# EAGLE design main_board (EAGLE 7.2.0)
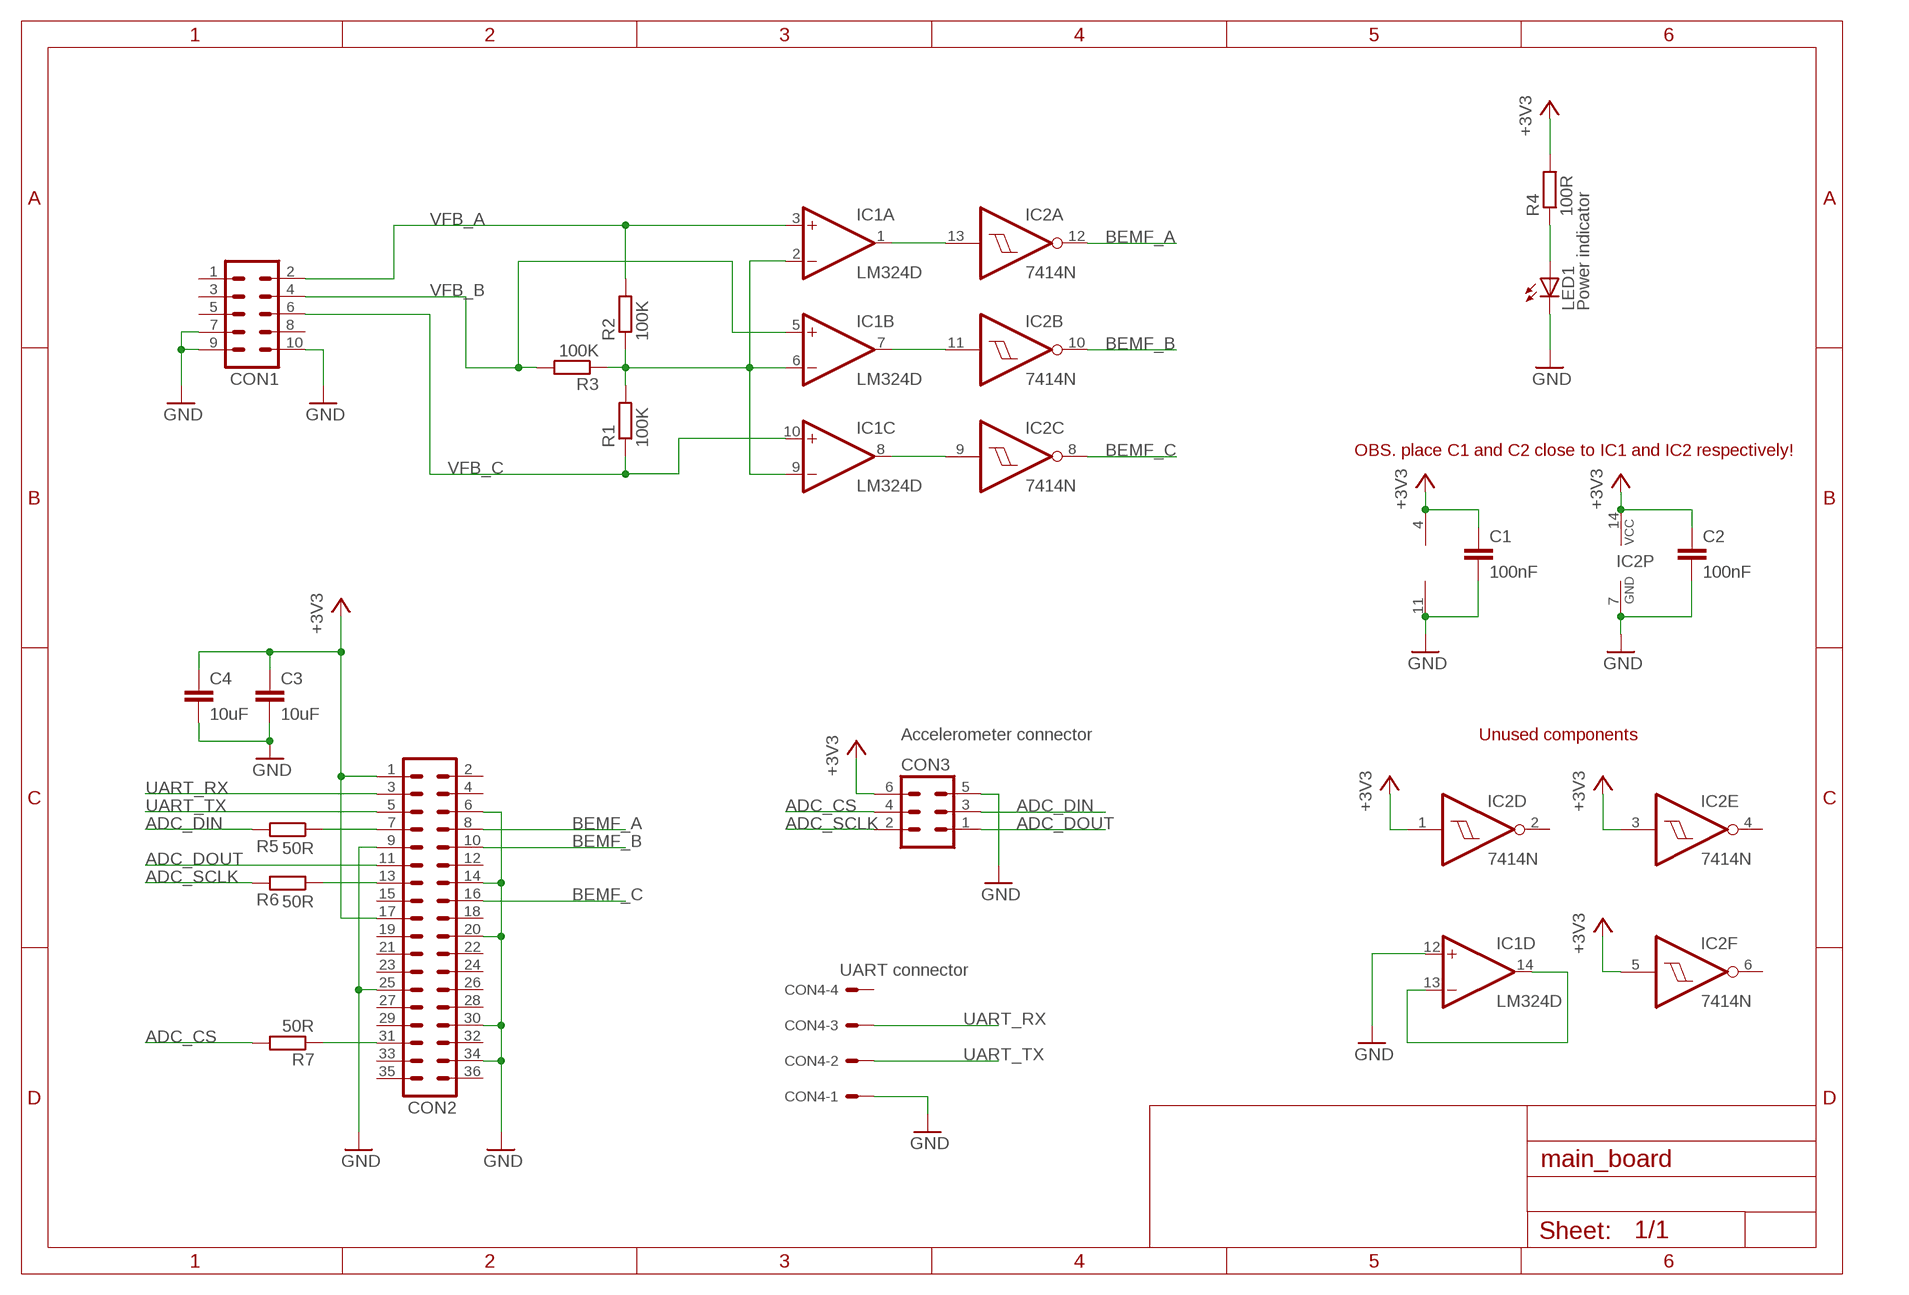
[diagram p0: schematic, sheet 1]

## Parts
C1  100nF  C-EUC0805K  [C0805K]
C2  100nF  C-EUC0805K  [C0805K]
C3  10uF  C-EUC1206K  [C1206K]
C4  10uF  C-EUC1206K  [C1206K]
CON1  MA05-2  [MA05-2]
CON2  MA18-2  [MA18-2]
CON3  Accelerometer connector  ML6  [ML6]
CON4  UART connector  22-27-2041-04  [6410-04]
IC1  LM324D  [SO14]
IC2  7414N  [DIL14]
LED1  Power indicator  LEDCHIP-LED0805  [CHIP-LED0805]
R1  100K  R-EU_R0805  [R0805]
R2  100K  R-EU_R0805  [R0805]
R3  100K  R-EU_R0805  [R0805]
R4  100R  R-EU_R0805  [R0805]
R5  50R  R-EU_R0805  [R0805]
R6  50R  R-EU_R0805  [R0805]
R7  50R  R-EU_R0805  [R0805]

## Nets
+3V3: C1.1 C2.1 C3.1 C4.1 CON2.1 CON2.17 CON3.6 IC1.4(P:V+) IC2.1(D:I) IC2.3(E:I) IC2.5(F:I) IC2.14(P:VCC) R4.2
ADC_CS: CON3.4 R7.2
ADC_DIN: CON3.3 R5.2
ADC_DOUT: CON2.11 CON3.1
ADC_SCLK: CON3.2 R6.2
BEMF_A: CON2.8 IC2.12(A:O)
BEMF_B: CON2.10 IC2.10(B:O)
BEMF_C: CON2.16 IC2.8(C:O)
GND: C1.2 C2.2 C3.2 C4.2 CON1.7 CON1.9 CON1.10 CON2.6 CON2.9 CON2.14 CON2.20 CON2.25 CON2.30 CON2.34 CON3.5 CON4.1 IC1.11(P:V-) IC1.12(D:+IN) IC2.7(P:GND) LED1.C
N$1: IC1.1(A:OUT) IC2.13(A:I)
N$2: IC1.7(B:OUT) IC2.11(B:I)
N$3: IC1.8(C:OUT) IC2.9(C:I)
N$4: IC1.2(A:-IN) IC1.6(B:-IN) IC1.9(C:-IN) R1.2 R2.1 R3.1
N$5: CON2.7 R5.1
N$6: CON2.13 R6.1
N$7: LED1.A R4.1
N$8: CON2.31 R7.1
N$9: IC1.13(D:-IN) IC1.14(D:OUT)
UART_RX: CON2.3 CON4.3
UART_TX: CON2.5 CON4.2
VFB_A: CON1.2 IC1.3(A:+IN) R2.2
VFB_B: CON1.4 IC1.5(B:+IN) R3.2
VFB_C: CON1.6 IC1.10(C:+IN) R1.1
Unconnected: CON1.1 CON1.3 CON1.5 CON1.8 CON2.2 CON2.4 CON2.12 CON2.15 CON2.18 CON2.19 CON2.21 CON2.22 CON2.23 CON2.24 CON2.26 CON2.27 CON2.28 CON2.29 CON2.32 CON2.33 CON2.35 CON2.36 CON4.4 IC2.2(D:O) IC2.4(E:O) IC2.6(F:O)

## Notes on the sheet
- OBS. place C1 and C2 close to IC1 and IC2 respectively!
- Unused components

## Library data of the parts
C1-C4 = rcl:C-EU: CAPACITOR, European symbol
CON1 = con-lstb:MA05-2: PIN HEADER; OC_FARNELL: unknown; OC_NEWARK: unknown
CON2 = con-lstb:MA18-2: PIN HEADER; OC_FARNELL: unknown; OC_NEWARK: unknown
CON3 = con-harting-ml:ML6: HARTING; OC_FARNELL: unknown; OC_NEWARK: unknown
CON4 = con-molex:22-?-04: CONNECTOR wire to board 2.54 mm (.1 inch) pitch header; OC_FARNELL: unknown; OC_NEWARK: unknown
IC1 = linear:LM324: OP AMP
IC2 = 74xx-eu:74*14: Hex schmitt trigger INVERTER
LED1 = led:LED: LED OSRAM: - CHIPLED LG R971, LG N971, LY N971, LG Q971, LY Q971, LO R971, LY R971 LH N974, LH R974 LS Q976, LO Q976, LY Q976 LO Q996 - Hyper CHIPLED LW Q18S LB Q993, LB Q99A, LB R99A - SideLED LS A670, LO A670, LY A670, LG A670, LP A670 LB A673, LV A673, LT A673, LW A673 LH A674 LY A675 LS A676, LA A676, LO A676, LY A676, LW A676 LS A679, LY A679, LG A679 - Hyper Micro SIDELED® LS Y876, LA Y876, LO Y876, LY Y876 LT Y87S - SmartLED LW L88C, LW L88S LB L89C, LB L89S, LG L890 LS L89K, LO L89K, LY L89K LS L896, LA L896, LO L896, LY L896 - TOPLED LS T670, LO T670, LY T670, LG T670, LP T670 LSG T670, LSP T670, LSY T670, LOP T670, LYG T670 LG T671, LOG T671, LSG T671 LB T673, LV T673, LT T673, LW T673 LH T674 LS T676, LA T676, LO T676, LY T676, LB T676, LH T676, LSB T676, LW T676 LB T67C, LV T67C, LT T67C, LS T67K, LO T67K, LY T67K, LW E67C LS E67B, LA E67B, LO E67B, LY E67B, LB E67C, LV E67C, LT E67C LW T67C LS T679, LY T679, LG T679 LS T770, LO T770, LY T770, LG T770, LP T770 LB T773, LV T773, LT T773, LW T773 LH T774 LS E675, LA E675, LY E675, LS T675 LS T776, LA T776, LO T776, LY T776, LB T776 LHGB T686 LT T68C, LB T68C - Hyper Mini TOPLED® LB M676 - Mini TOPLED Santana® LG M470 LS M47K, LO M47K, LY M47K Source: http://www.osram.convergy.de LUXEON: - LUMILED® LXK2-PW12-R00, LXK2-PW12-S00, LXK2-PW14-U00, LXK2-PW14-V00 LXK2-PM12-R00, LXK2-PM12-S00, LXK2-PM14-U00 LXK2-PE12-Q00, LXK2-PE12-R00, LXK2-PE12-S00, LXK2-PE14-T00, LXK2-PE14-U00 LXK2-PB12-K00, LXK2-PB12-L00, LXK2-PB12-M00, LXK2-PB14-N00, LXK2-PB14-P00, LXK2-PB14-Q00 LXK2-PR12-L00, LXK2-PR12-M00, LXK2-PR14-Q00, LXK2-PR14-R00 LXK2-PD12-Q00, LXK2-PD12-R00, LXK2-PD12-S00 LXK2-PH12-R00, LXK2-PH12-S00 LXK2-PL12-P00, LXK2-PL12-Q00, LXK2-PL12-R00 Source: www.luxeon.com KINGBRIGHT: KA-3528ASYC Source: www.kingbright.com
R1-R7 = rcl:R-EU_: RESISTOR, European symbol

## Board
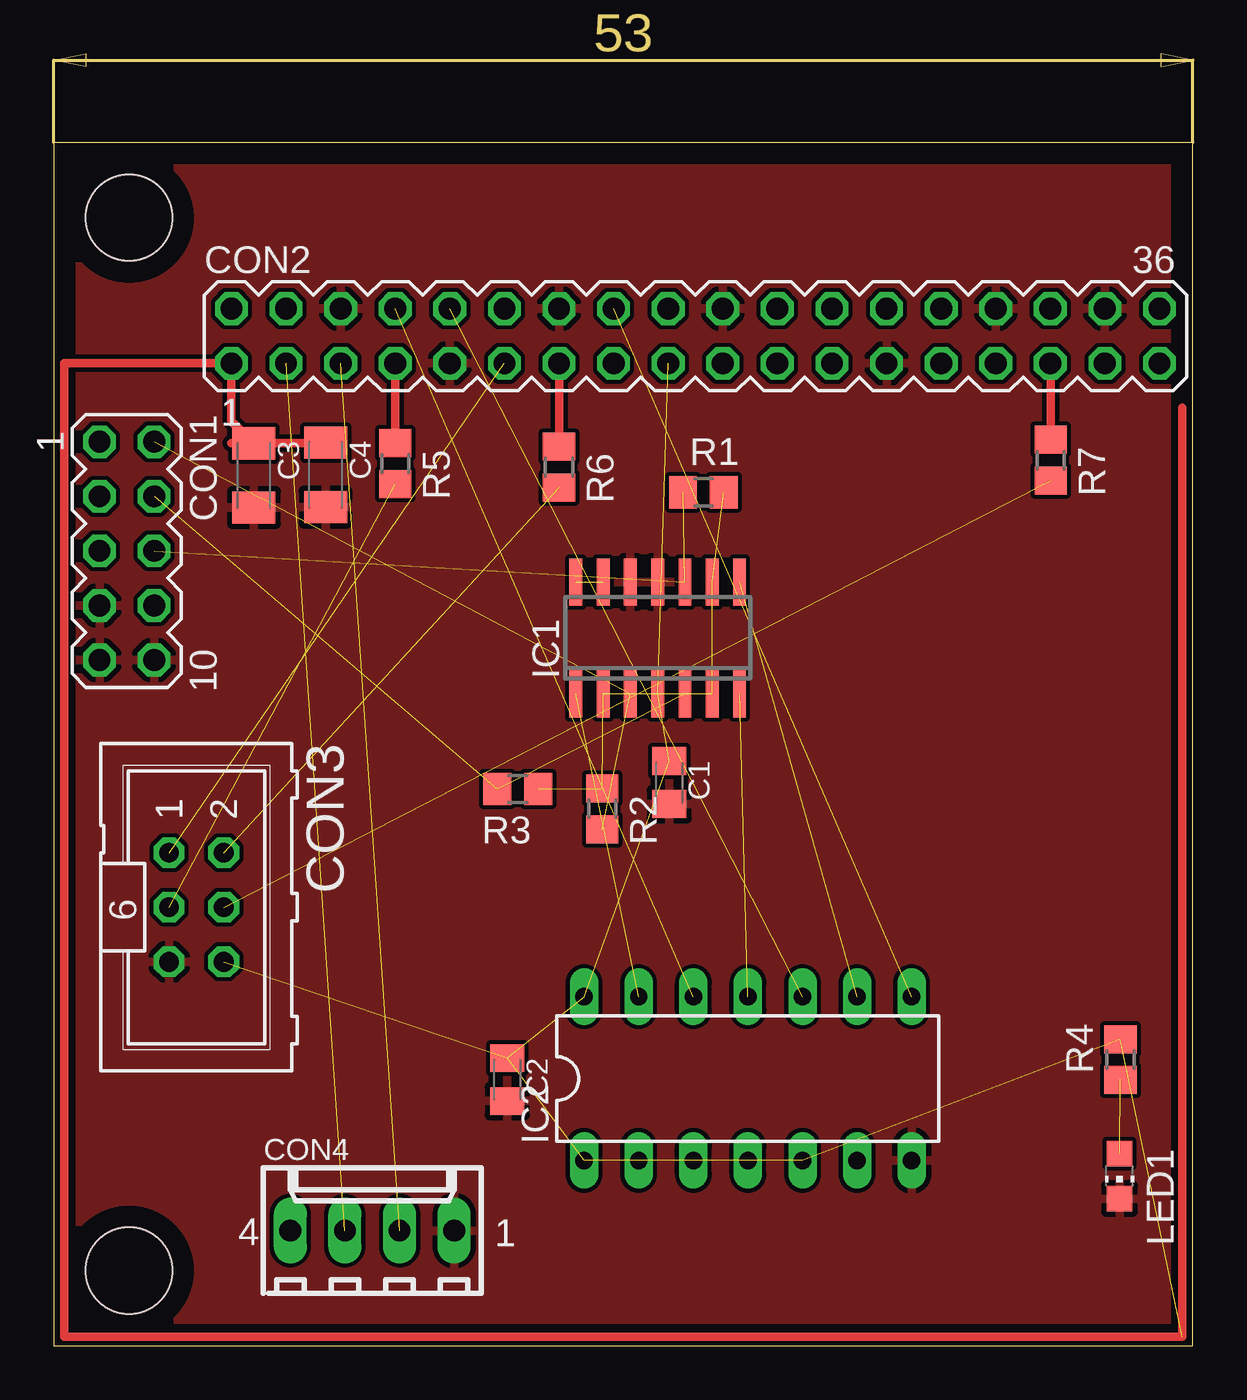
[diagram p1: board, top side]
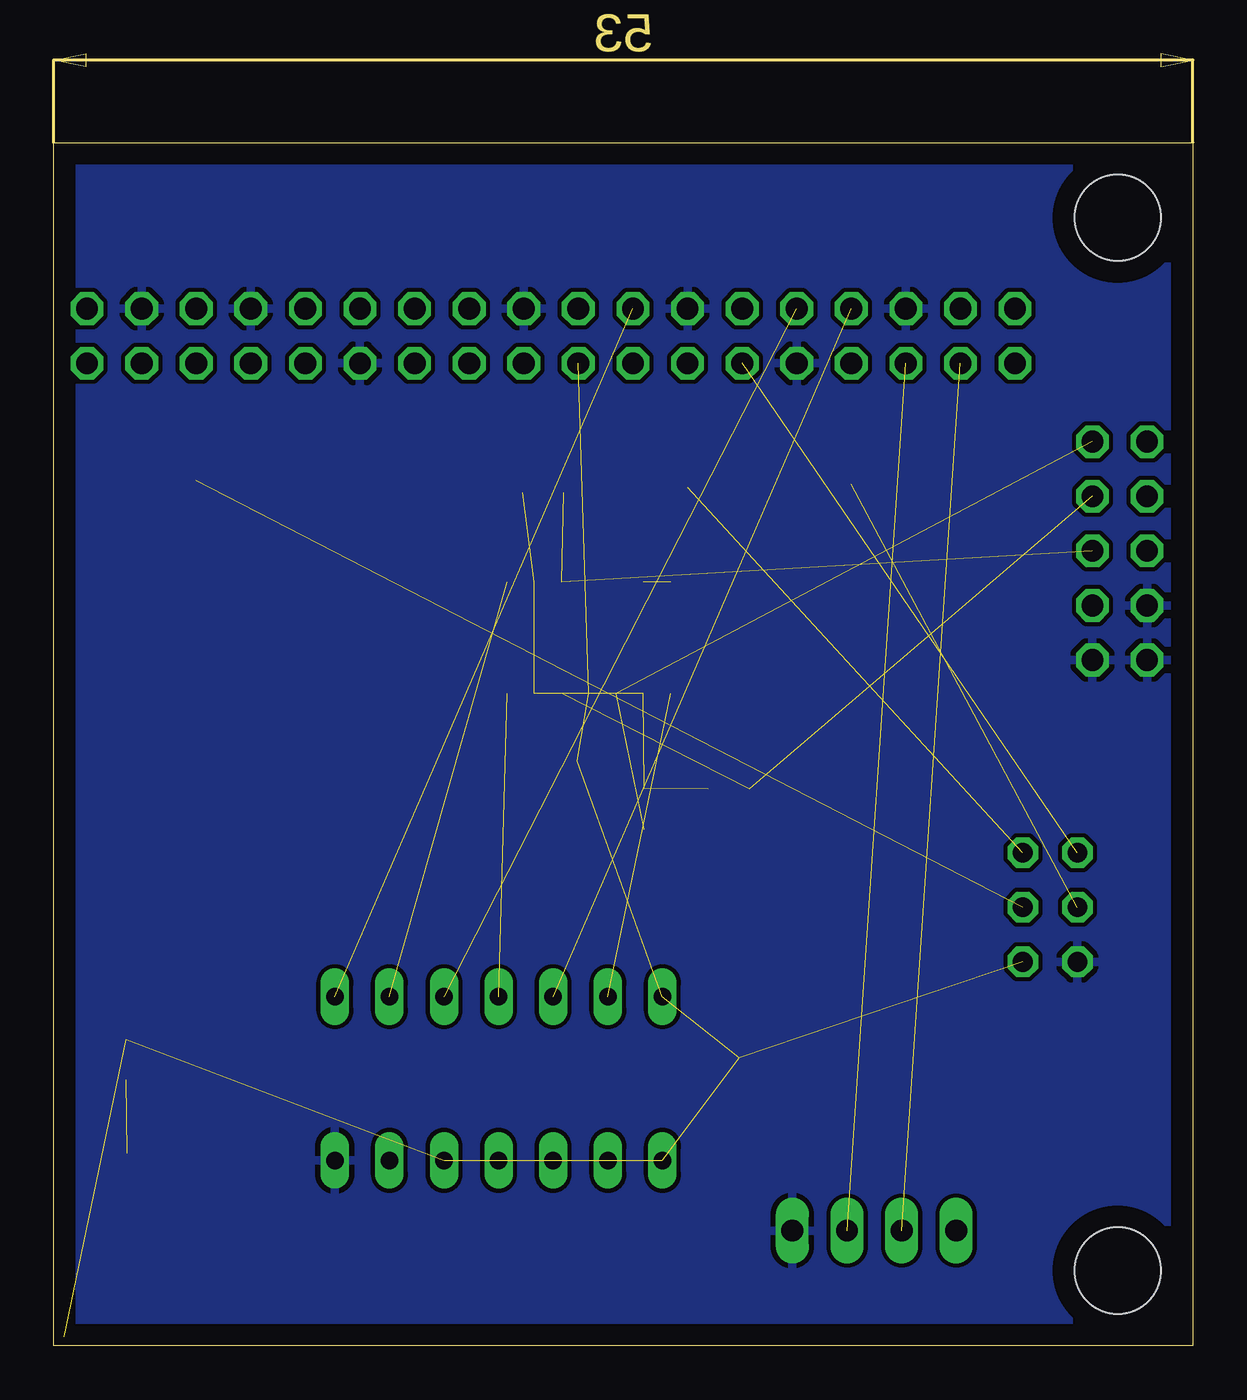
[diagram p2: board, bottom side, seen from below]

Size 53 x 56 mm. Coordinates in mm from the lower left corner, seen from the top.
Outline: 0,0 53,0 53,56 0,56 0,0
Copper layers (1*16): Top 0.035mm / dielectric 1.5mm / Bottom 0.035mm
Design rules "default": minimum track width 10mil, minimum drill 24mil, track to track 8mil, track to pad 8mil, pad to pad 8mil, via to via 8mil, smd to smd 8mil, copper to edge 40mil, drill to drill 8mil, minimum pad ring 10mil, minimum via ring 8mil, stop-mask expansion 4mil, vias tented up to drill 0mil, thermal gap 10mil
Holes 4 mm at 3.5,52.5 61.5,52.5 3.5,3.5 61.5,3.5

### Footprints (pad centres in the part's own frame; a part is rotated, then mirrored left to right if it is on the bottom)
C0805K = smd 1.3 x 1.6: 1 -1,0; 2 1,0
C1206K = smd 1.5 x 2: 1 -1.5,0; 2 1.5,0
MA05-2 = drill 1.016 octagon: 1 -5.08,-1.27; 2 -5.08,1.27; 3 -2.54,-1.27; 4 -2.54,1.27; 5 0,-1.27; 6 0,1.27; 7 2.54,-1.27; 8 2.54,1.27; 9 5.08,-1.27; 10 5.08,1.27
MA18-2 = drill 1.016 octagon: 1 -21.59,-1.27; 2 -21.59,1.27; 3 -19.05,-1.27; 4 -19.05,1.27; 5 -16.51,-1.27; 6 -16.51,1.27; 7 -13.97,-1.27; 8 -13.97,1.27; 9 -11.43,-1.27; 10 -11.43,1.27; 11 -8.89,-1.27; 12 -8.89,1.27; 13 -6.35,-1.27; 14 -6.35,1.27; 15 -3.81,-1.27; 16 -3.81,1.27; 17 -1.27,-1.27; 18 -1.27,1.27; 19 1.27,-1.27; 20 1.27,1.27; 21 3.81,-1.27; 22 3.81,1.27; 23 6.35,-1.27; 24 6.35,1.27; 25 8.89,-1.27; 26 8.89,1.27; 27 11.43,-1.27; 28 11.43,1.27; 29 13.97,-1.27; 30 13.97,1.27; 31 16.51,-1.27; 32 16.51,1.27; 33 19.05,-1.27; 34 19.05,1.27; 35 21.59,-1.27; 36 21.59,1.27
ML6 = drill 0.914 octagon: 1 -2.54,-1.27; 2 -2.54,1.27; 3 0,-1.27; 4 0,1.27; 5 2.54,-1.27; 6 2.54,1.27
6410-04 = drill 1.016 long: 1 3.81,0; 2 1.27,0; 3 -1.27,0; 4 -3.81,0
SO14 = smd 0.6 x 2.2: 1 -3.81,-2.6; 2 -2.54,-2.6; 3 -1.27,-2.6; 4 0,-2.6; 5 1.27,-2.6; 6 2.54,-2.6; 7 3.81,-2.6; 8 3.81,2.6; 9 2.54,2.6; 10 1.27,2.6; 11 0,2.6; 12 -1.27,2.6; 13 -2.54,2.6; 14 -3.81,2.6
DIL14 = drill 0.813 long: 1 -7.62,-3.81; 2 -5.08,-3.81; 3 -2.54,-3.81; 4 0,-3.81; 5 2.54,-3.81; 6 5.08,-3.81; 7 7.62,-3.81; 8 7.62,3.81; 9 5.08,3.81; 10 2.54,3.81; 11 0,3.81; 12 -2.54,3.81; 13 -5.08,3.81; 14 -7.62,3.81
CHIP-LED0805 = smd 1.2 x 1.2: A 0,-1.05; C 0,1.05
R0805 = smd 1.3 x 1.5: 1 -0.95,0; 2 0.95,0

### Placement (x,y rotation side)
C1  28.64,26.21 270 top
C2  21.1,12.39 270 top
C3  9.31,40.51 270 top
C4  12.65,40.54 270 top
CON1  3.4,37 270 top
CON2  29.86,47 0 top
CON3  6.64,20.41 270 top
CON4  14.82,5.36 0 top
IC1  28.1,32.95 0 top
IC2  32.3,12.44 0 top
LED1  49.59,7.9 180 top
R1  30.23,39.72 0 top
R2  25.52,24.99 270 top
R3  21.59,25.92 180 top
R4  49.63,13.32 90 top
R5  15.89,41.06 270 top
R6  23.51,40.9 270 top
R7  46.39,41.22 270 top

### Tracks (layer width: path | path; a pad name or v marks a point on that pad's centre or on a via)
+3V3  (10 unrouted)
  Top 0.406: C3.1 8.27,42.01 | 9.31,42.04 C3.1 | 52.51,43.67 52.51,0.43 0.5,0.43 0.5,45.73 CON2.1 8.27,43.05 C3.1 | C3.1 12.62,42.01 C4.1
ADC_CS  (1 unrouted)
ADC_DIN  (1 unrouted)
ADC_DOUT  (1 unrouted)
ADC_SCLK  (1 unrouted)
BEMF_A  (1 unrouted)
BEMF_B  (1 unrouted)
BEMF_C  (1 unrouted)
GND
  pour Bottom: -12.1,63.71 65.38,63.71 65.38,-3.57 -12.1,-3.57
  pour Top: -14.64,64.98 67.53,64.98 67.53,-6.36 -14.64,-6.36
N$1  (1 unrouted)
N$2  (1 unrouted)
N$3  (1 unrouted)
N$4  (5 unrouted)
N$5
  Top 0.406: CON2.7 R5.1
N$6
  Top 0.406: CON2.13 R6.1
N$7  (1 unrouted)
N$8
  Top 0.406: CON2.31 46.39,45.73 R7.1
N$9  (1 unrouted)
UART_RX  (1 unrouted)
UART_TX  (1 unrouted)
VFB_A  (2 unrouted)
VFB_B  (2 unrouted)
VFB_C  (2 unrouted)